# EAGLE schematic SpiritLevel (EAGLE 9.3.1)

## Sheet 1 of 2
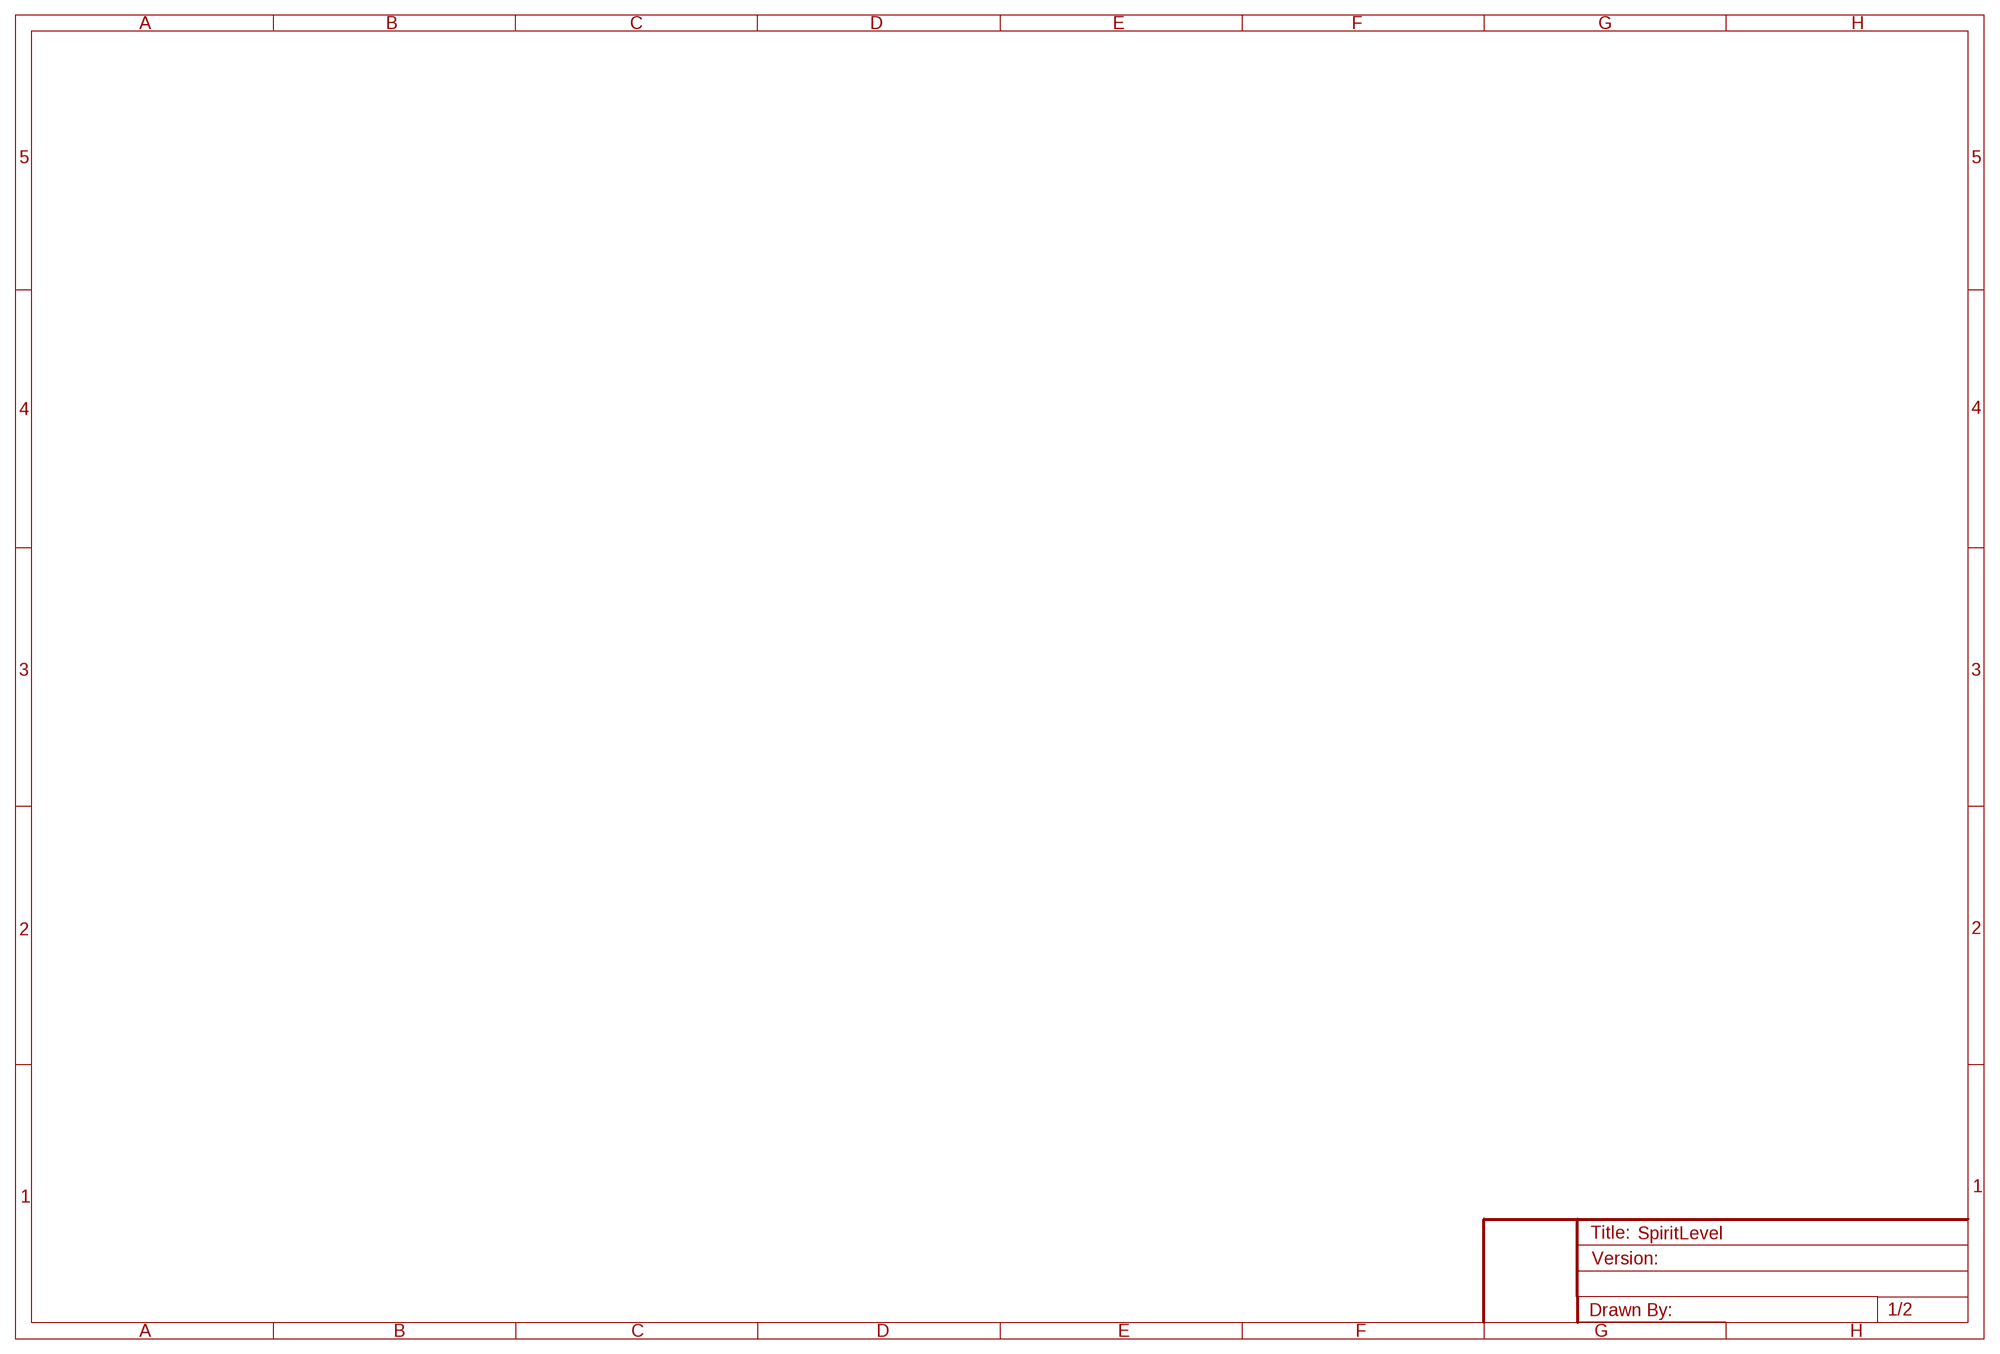
[diagram p0: schematic, sheet 1]

## Sheet 2 of 2
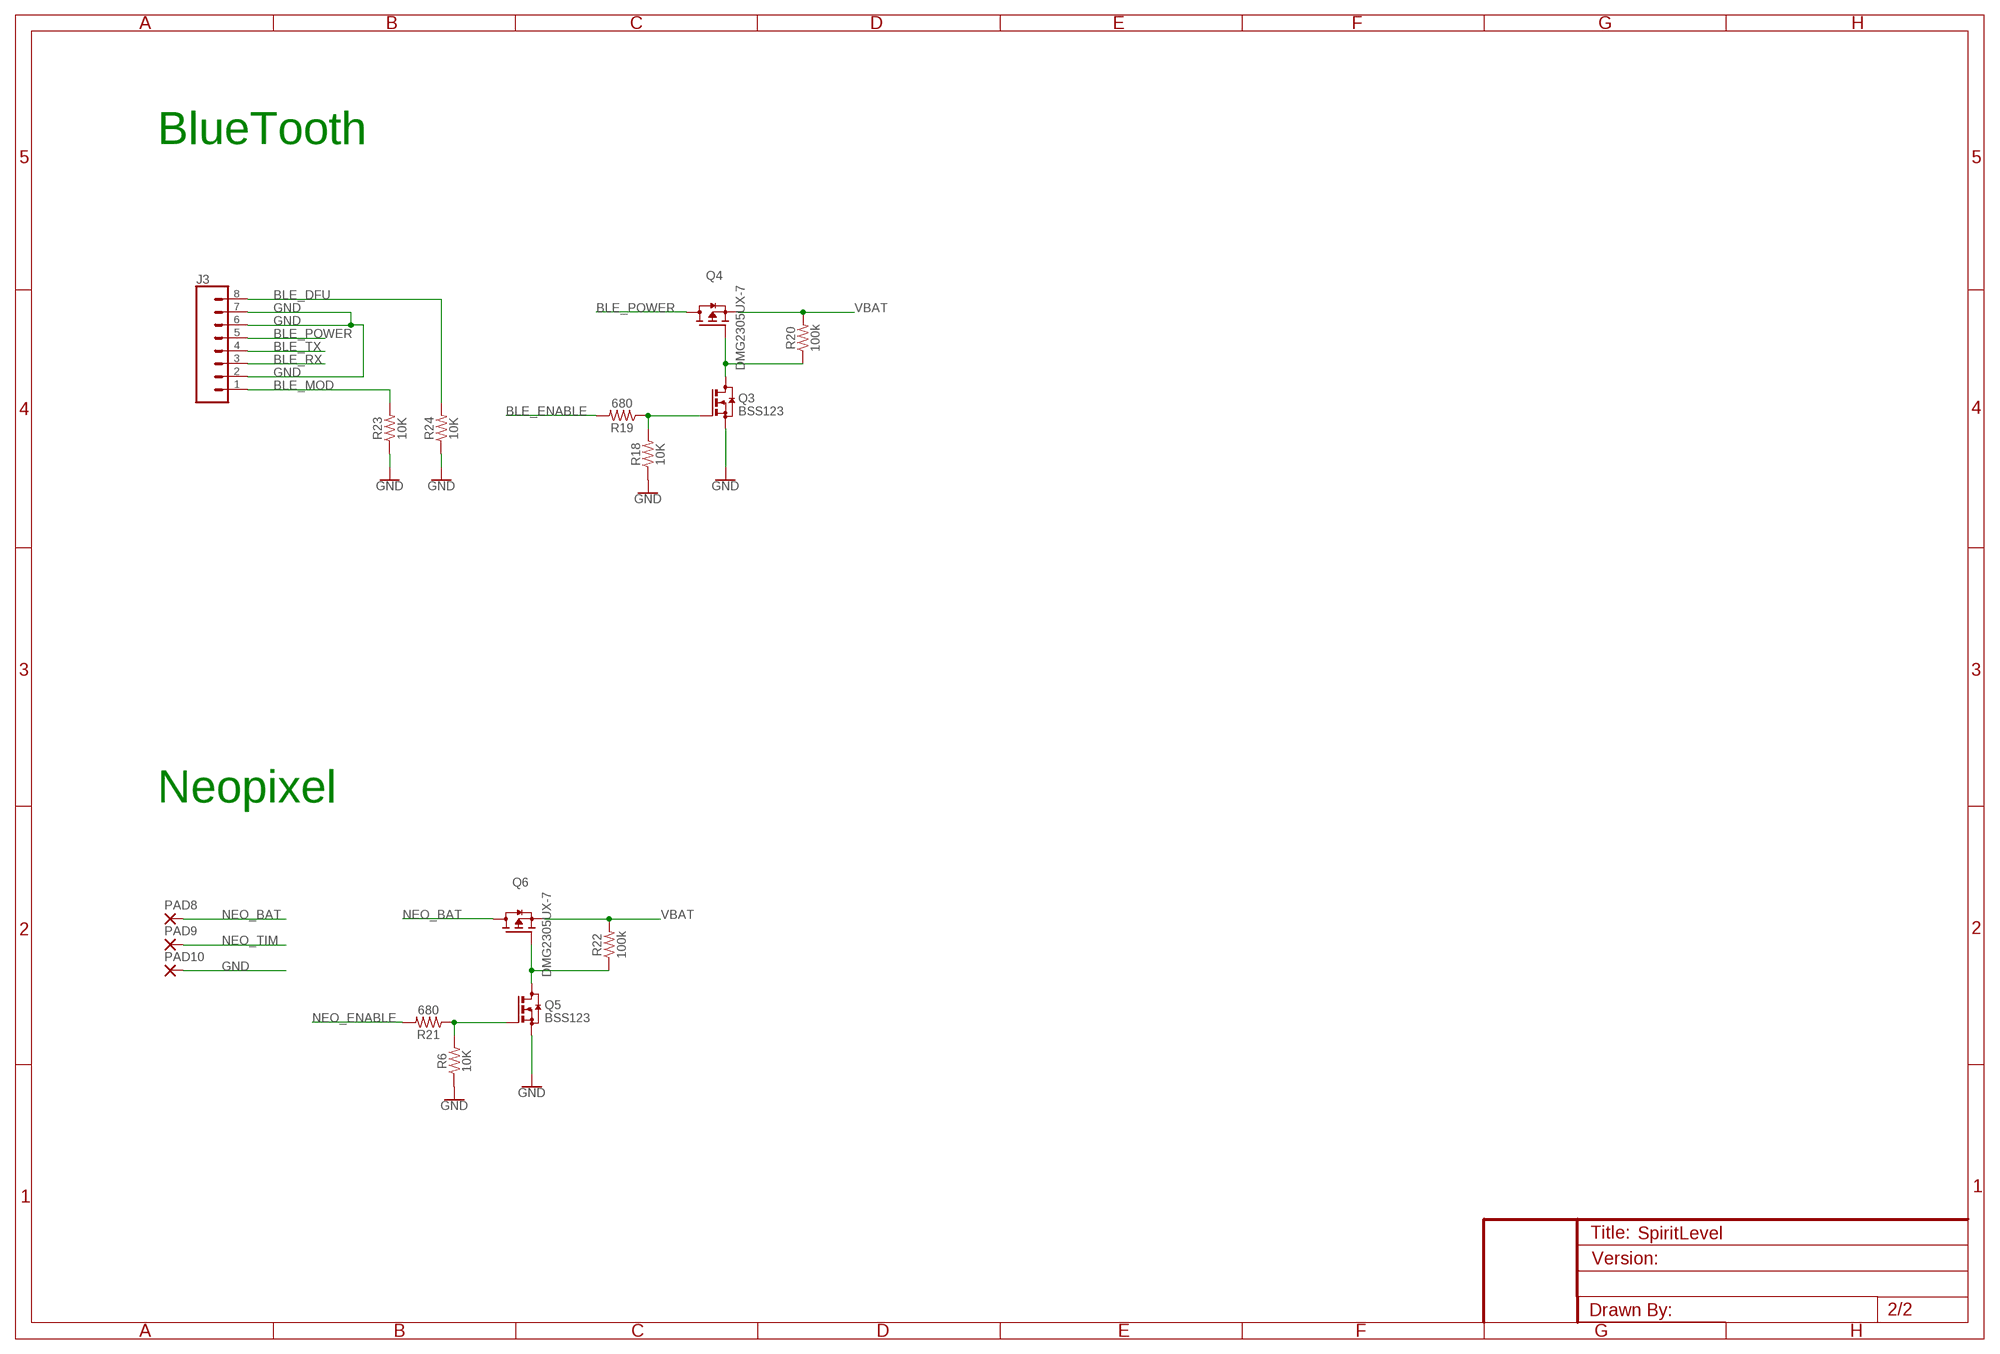
[diagram p1: schematic, sheet 2]

### Parts
J3  CONN_08FEMALE_LOCK  [1X08_FEMALE_LOCK]
PAD8  SMD5  [SMD2,54-5,08]
PAD9  SMD5  [SMD2,54-5,08]
PAD10  SMD5  [SMD2,54-5,08]
Q3  BSS123  [SOT23]
Q4  DMG2305UX-7  [SOT91P240X110-3N_DMG2305UX-7]
Q5  BSS123  [SOT23]
Q6  DMG2305UX-7  [SOT91P240X110-3N_DMG2305UX-7]
R6  10K  100KOHM-0402-1/16W-1%  [0402]
R18  10K  100KOHM-0402-1/16W-1%  [0402]
R19  680  100KOHM-0402-1/16W-1%  [0402]
R20  100k  100KOHM-0603-1/10W-1%  [0603]
R21  680  100KOHM-0402-1/16W-1%  [0402]
R22  100k  100KOHM-0603-1/10W-1%  [0603]
R23  10K  100KOHM-0402-1/16W-1%  [0402]
R24  10K  100KOHM-0402-1/16W-1%  [0402]

### Nets
BLE_DFU: J3.8 R24.2
BLE_ENABLE: R19.2
BLE_MOD: J3.1 R23.2
BLE_POWER: J3.5 Q4.3(D)
BLE_RX: J3.3
BLE_TX: J3.4
GND: J3.2 J3.6 J3.7 PAD10.1(P) Q3.2(S) Q5.2(S) R6.1 R18.1 R23.1 R24.1
N$9: Q5.1(G) R6.2 R21.1
N$10: Q5.3(D) Q6.1(G) R22.1
N$31: Q3.1(G) R18.2 R19.1
N$32: Q3.3(D) Q4.1(G) R20.1
NEO_BAT: PAD8.1(P) Q6.3(D)
NEO_ENABLE: R21.2
NEO_TIM: PAD9.1(P)
VBAT: Q4.2(S) Q6.2(S) R20.2 R22.2

### Notes on the sheet
- BlueTooth
- Neopixel

## Library data of the parts
J3 = SparkFun-Connectors:CONN_08: Multi connection point. Often used as Generic Header-pin footprint for 0.1 inch spaced/style header connections On any of the 0.1 inch spaced packages, you can populate with these: Break Away Headers - Straight <https://www.sparkfun.com/products/116> (PRT-00116) Break Away Male Headers - Right Angle <https://www.sparkfun.com/products/553> (PRT-00553) Female Headers <https://www.sparkfun.com/products/115> (PRT-00115) Break Away Headers - Machine Pin <https://www.sparkfun.com/products/117> (PRT-00117) Break Away Female Headers - Swiss Machine Pin <https://www.sparkfun.com/products/743> (PRT-00743) Arduino Stackable Header - 8 Pin <https://www.sparkfun.com/products/9279> (PRT-09279) For SCREWTERMINALS and SPRING TERMINALS visit here: Screw Terimnals on SparkFun.com <https://www.sparkfun.com/search/results?term=Screw+Terminals> (5mm/3.5mm/2.54mm spacing) This device is also useful as a general connection point to wire up your design to another part of your project. Our various solder wires solder well into these plated through hole pads. Hook-Up Wire - Assortment (Stranded, 22 AWG) <https://www.sparkfun.com/products/11375> (PRT-11375) Hook-Up Wire - Assortment (Solid Core, 22 AWG) <https://www.sparkfun.com/products/11367> (PRT-11367) View the entire wire category on our website here <https://www.sparkfun.com/categories/141> Special notes: Molex polarized connector foot print use with SKU : PRT-08231 with associated crimp pins and housings. 1MM SMD Version SKU: PRT-10208 NOTES ON THE VARIANTS LOCK and LOCK_LONGPADS... This footprint was designed to help hold the alignment of a through-hole component (i.e. 6-pin header) while soldering it into place. You may notice that each hole has been shifted either up or down by 0.005 of an inch from it's more standard position (which is a perfectly straight line). This slight alteration caused the pins (the squares in the middle) to touch the edges of the holes. Because they are alternating, it causes a "brace" to hold the component in place. 0.005 has proven to be the perfect amount of "off-center" position when using our standard breakaway headers. Although looks a little odd when you look at the bare footprint, once you have a header in there, the alteration is very hard to notice. Also,if you push a header all the way into place, it is covered up entirely on the bottom side.; PROD_ID: CONN-09233; SF_ID: PRT-09279
PAD8-PAD10 = wirepad:SMD5: SMD PAD
Q3 Q5 = transistor-small-signal:BSS123: N-CHANNEL MOS FET
Q4 Q6 = DMG2305UX-7:DMG2305UX-7: DMG2305UX Series 20 V 65 Ohms P-Ch Enhancement Mode Mosfet - SOT-23-3; AVAILABILITY: Unavailable; DESCRIPTION: P-Channel 20V 4.2A _Ta_ 1.4W _Ta_ Surface Mount SOT-23; MF: Diodes Inc.; MP: DMG2305UX-7; PACKAGE: SOT-23-3 Diodes Inc.; PRICE: None
R6 R18 R19 R21 R23 R24 = SparkFun-Resistors:100KOHM: 100kΩ resistor A resistor is a passive two-terminal electrical component that implements electrical resistance as a circuit element. Resistors act to reduce current flow, and, at the same time, act to lower voltage levels within circuits. - Wikipedia; PROD_ID: RES-13495; VALUE: 100K
R20 R22 = SparkFun-Resistors:100KOHM: 100kΩ resistor A resistor is a passive two-terminal electrical component that implements electrical resistance as a circuit element. Resistors act to reduce current flow, and, at the same time, act to lower voltage levels within circuits. - Wikipedia; PROD_ID: RES-07828